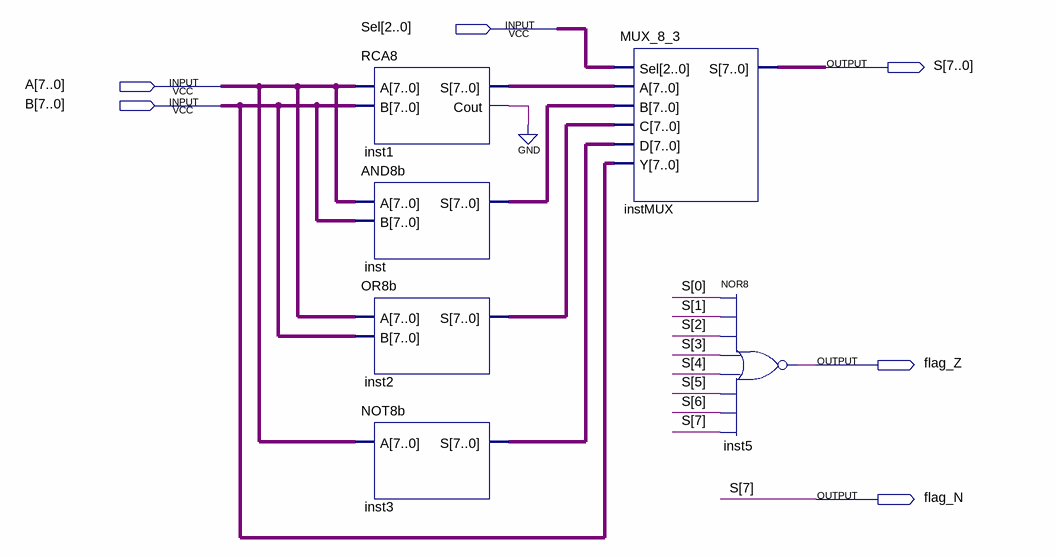
[diagram p0: schematic sheet]
// Quartus schematic ULA.bdf as structural Verilog: 6 symbols, 6 pins
module ULA (
  input  [2:0] Sel,
  input  [7:0] A,
  input  [7:0] B,
  output [7:0] S,
  output flag_Z,
  output flag_N
);

  wire inst1_cout;
  wire [7:0] inst1_s, inst2_s, inst3_s, inst_s;

  RCA8 inst1 (.A(A), .B(B), .S(inst1_s), .Cout(inst1_cout));
  AND8b inst (.A(A), .B(B), .S(inst_s));
  OR8b inst2 (.A(A), .B(B), .S(inst2_s));
  NOT8b inst3 (.A(A), .S(inst3_s));
  MUX_8_3 instMUX (.Sel(Sel), .A(inst1_s), .B(inst_s), .C(inst2_s), .D(inst3_s), .Y(B), .S({flag_N, S[6:0]}));
  nor inst5 (flag_Z, S[0], S[1], S[2], S[3], S[4], S[5], S[6], flag_N);

  assign S[7] = flag_N;
  // also tied to GND on the sheet: inst1_cout
endmodule
